# Altium schematic sheet H750Common2.SchDoc
size A3
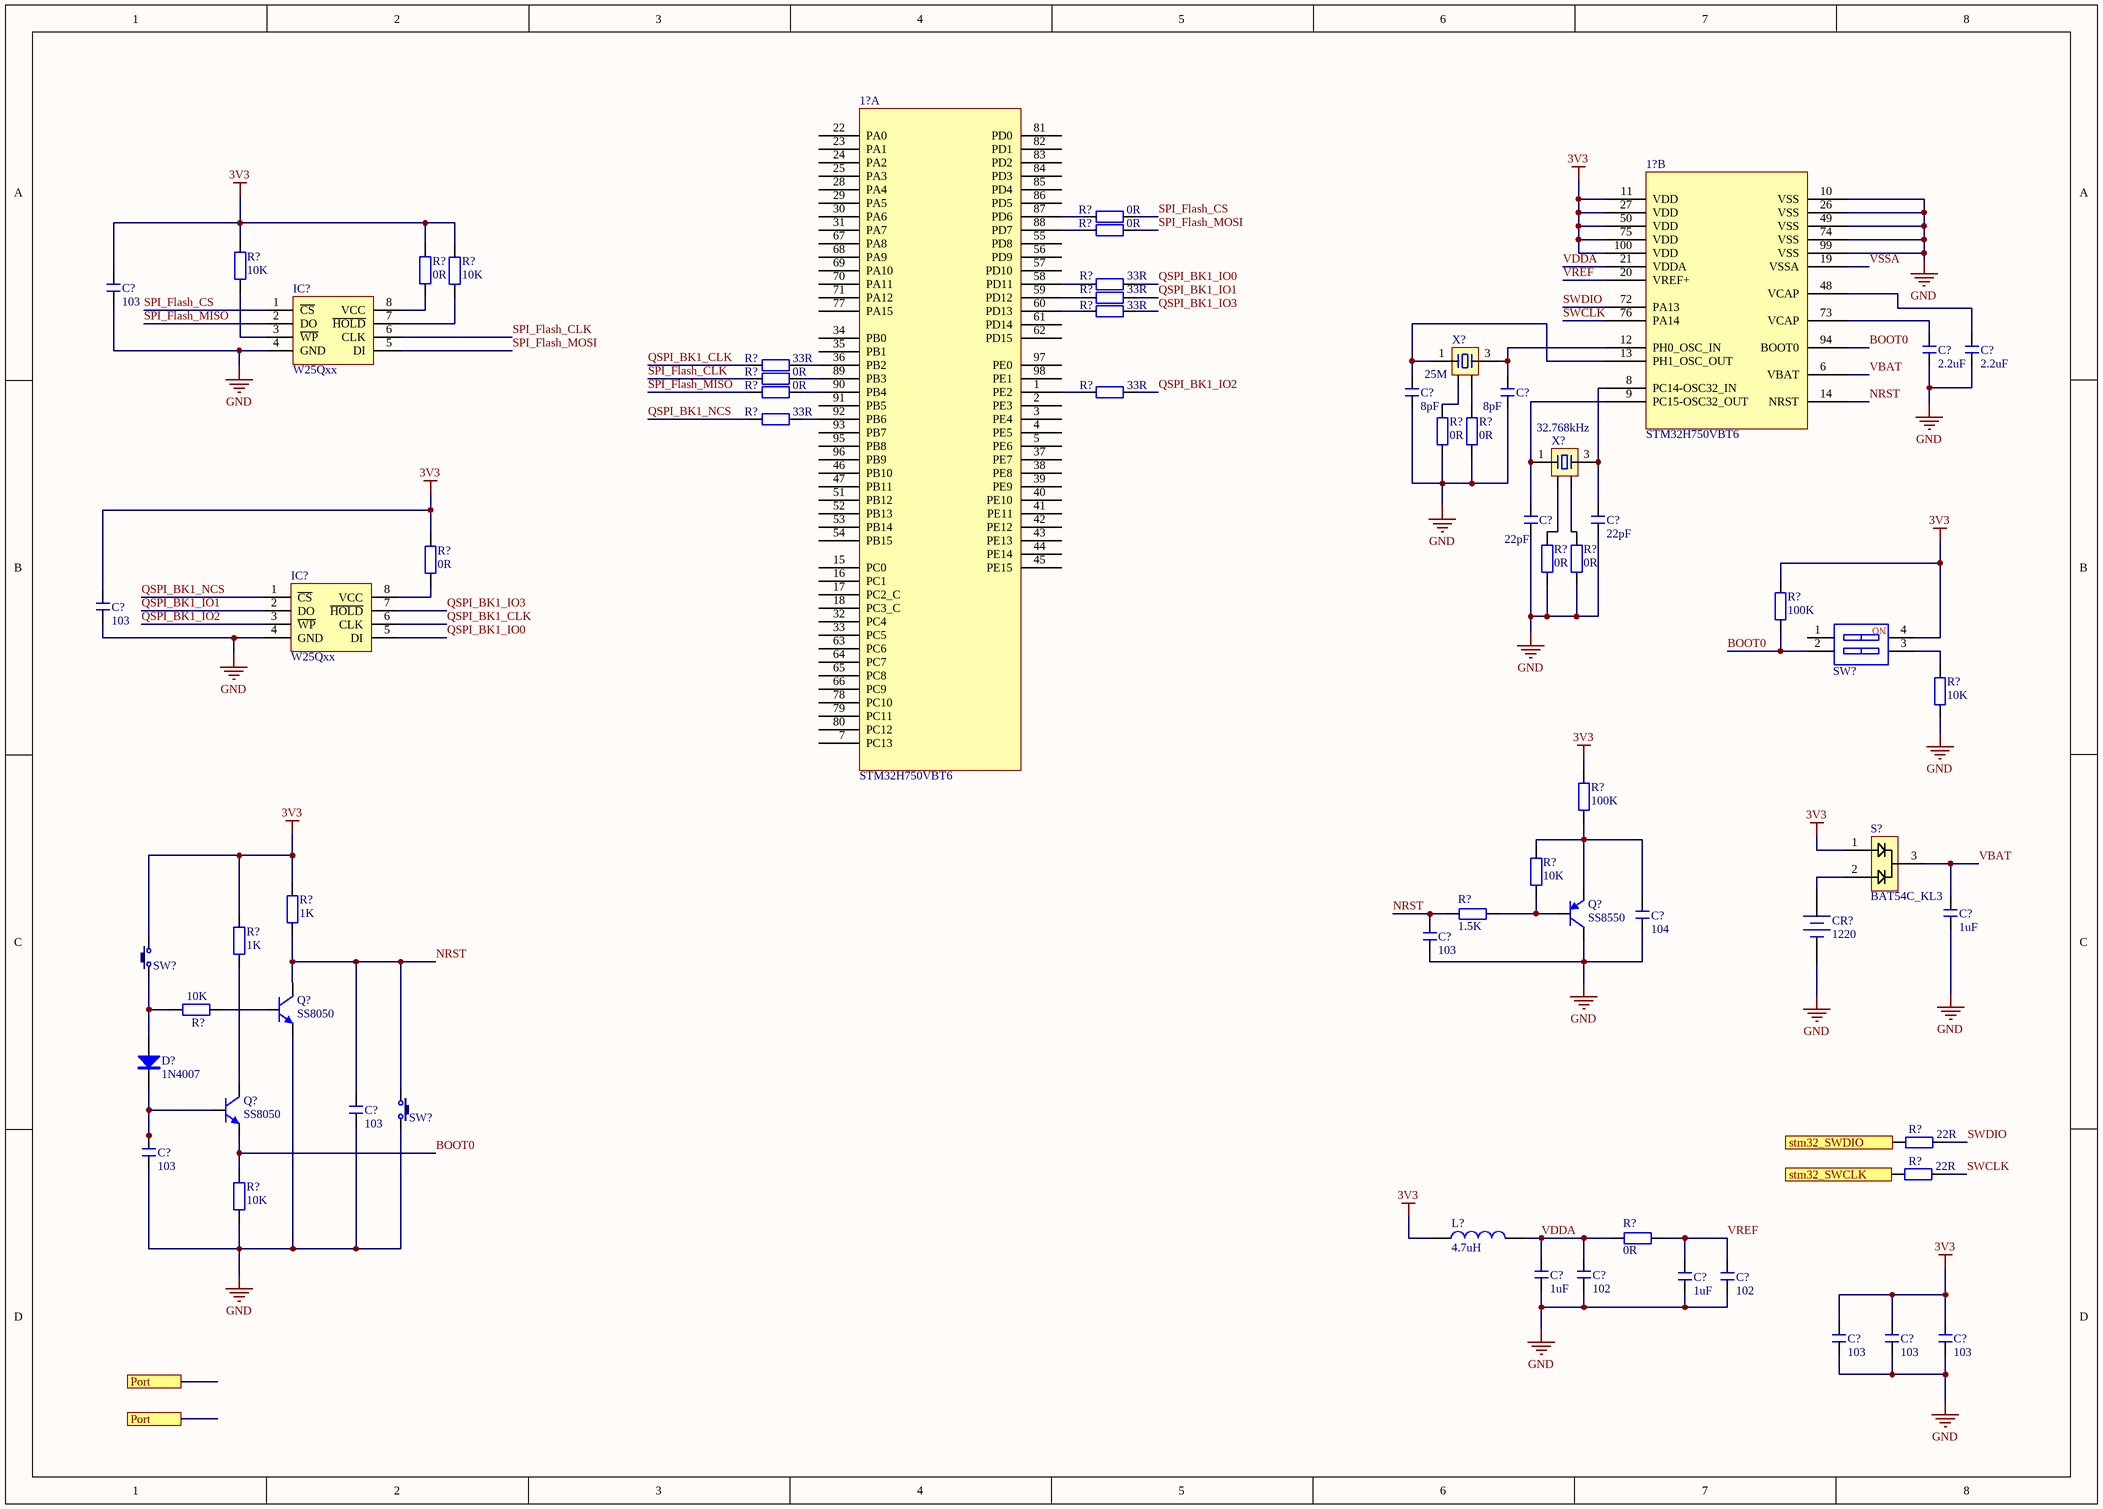
[diagram p0: H750Common2.SchDoc]

## Parts
(Parts that share a designator on the sheet are numbered #1, #2 ... from top to bottom, then left to right.)
1?#1  STM32H750VBT6  [F-QFP14x14-G100/P.5N]  (part B of 2)
1?#2  STM32H750VBT6  [F-QFP14x14-G100/P.5N]  (part A of 2)
C?#1  103  [C 0603_L]
C?#2  2.2uF  [C 0603_L]
C?#3  2.2uF  [C 0603_L]
C?#4  8pF  [C 0603_L]
C?#5  8pF  [C 0603_L]
C?#6  22pF  [C 0603_L]
C?#7  22pF  [C 0603_L]
C?#8  103  [C 0603_L]
C?#9  104  [C 0603_L]
C?#10  1uF  [C 0603_L]
C?#11  103  [C 0603_L]
C?#12  103  [C 0603_L]
C?#13  103  [C 0603_L]
C?#14  1uF  [C 0603_L]
C?#15  102  [C 0603_L]
C?#16  1uF  [C 0603_L]
C?#17  102  [C 0603_L]
C?#18  103  [C 0603_L]
C?#19  103  [C 0603_L]
C?#20  103  [C 0603_L]
CR?  1220  [CR1220_A]
D?  1N4007  [SMA]
IC?#1  W25Qxx  [SOP8W_N]
IC?#2  W25Qxx  [SOP8W_N]
L?  4.7uH  [L 0603]
Q?#1  SS8550  [SOT23-3N]
Q?#2  SS8050  [SOT23-3N]
Q?#3  SS8050  [SOT23-3N]
R?#1  0R  [R 0603_L]
R?#2  0R  [R 0603_L]
R?#3  10K  [R 0603_L]
R?#4  10K  [R 0603_L]
R?#5  33R  [R 0603_L]
R?#6  0R  [R 0603_L]
R?#7  33R  [R 0603_L]
R?#8  33R  [R 0603_L]
R?#9  33R  [R 0603_L]
R?#10  0R  [R 0603_L]
R?#11  0R  [R 0603_L]
R?#12  33R  [R 0603_L]
R?#13  33R  [R 0603_L]
R?#14  0R  [R 0603_L]
R?#15  0R  [R 0603_L]
R?#16  0R  [R 0603_L]
R?#17  0R  [R 0603_L]
R?#18  0R  [R 0603_L]
R?#19  100K  [R 0603_L]
R?#20  10K  [R 0603_L]
R?#21  100K  [R 0603_L]
R?#22  1K  [R 0603_L]
R?#23  10K  [R 0603_L]
R?#24  1K  [R 0603_L]
R?#25  1.5K  [R 0603_L]
R?#26  10K  [R 0603_L]
R?#27  22R  [R 0603_L]
R?#28  10K  [R 0603_L]
R?#29  22R  [R 0603_L]
R?#30  0R  [R 0603_L]
S?  BAT54C_KL3  [SO-G3/C2.25]
SW?#1  CSW-2P  [CSW1.27 SMD-2P]  (value not drawn)
SW?#2  3x6x5  [TSW SMD-3*6*2.5]  (value not drawn)
SW?#3  3x6x5  [TSW SMD-3*6*2.5]  (value not drawn)
X?#1  25M  [OSC 5032-4P]
X?#2  32.768kHz  [OSC 5032-4P]

## Ports
Port, stm32_SWCLK (in), stm32_SWDIO (in)

## Nets
3V3: 1?#1.11(VDD) 1?#1.27(VDD) 1?#1.50(VDD) 1?#1.75(VDD) 1?#1.100(VDD) C?#1.1 C?#8.1 C?#18.2 C?#19.2 C?#20.2 L?.1 R?#3.1 R?#4.1 R?#6.2 R?#16.2 R?#19.2 R?#21.2 R?#22.1 R?#24.1 S?.1 SW?#1.4 SW?#2.2
GND: 1?#1.10(VSS) 1?#1.26(VSS) 1?#1.49(VSS) 1?#1.74(VSS) 1?#1.99(VSS) C?#1.2 C?#2.1 C?#3.1 C?#4.1 C?#5.1 C?#6.1 C?#7.1 C?#8.2 C?#9.1 C?#10.1 C?#11.1 C?#12.1 C?#13.1 C?#14.1 C?#15.1 C?#16.1 C?#17.1 C?#18.1 C?#19.1 C?#20.1 CR?.2(DC-) IC?#1.4(GND) IC?#2.4(GND) Q?#1.3(C) Q?#2.2(E) R?#14.1 R?#15.1 R?#17.1 R?#18.1 R?#20.1 R?#28.2 SW?#3.2
BOOT0: 1?#1.94(BOOT0) Q?#3.2(E) R?#19.1 R?#28.1 SW?#1.2
NRST: 1?#1.14(NRST) C?#11.2 C?#12.2 Q?#2.3(C) R?#22.2 R?#25.2 SW?#3.1
QSPI_BK1_CLK: IC?#2.6(CLK) R?#9.2
QSPI_BK1_IO0: IC?#2.5(DI) R?#5.1
QSPI_BK1_IO1: IC?#2.2(DO) R?#7.1
QSPI_BK1_IO2: IC?#2.3(~{WP}) R?#12.1
QSPI_BK1_IO3: IC?#2.7(~{HOLD}) R?#8.1
QSPI_BK1_NCS: IC?#2.1(~{CS}) R?#13.2
SPI_Flash_CLK: IC?#1.6(CLK) R?#10.2
SPI_Flash_CS: IC?#1.1(~{CS}) R?#1.1
SPI_Flash_MISO: IC?#1.2(DO) R?#11.2
SPI_Flash_MOSI: IC?#1.5(DI) R?#2.1
stm32_SWCLK: R?#29.2 ; port stm32_SWCLK
stm32_SWDIO: R?#27.2 ; port stm32_SWDIO
SWCLK: 1?#1.76(PA14) R?#29.1
SWDIO: 1?#1.72(PA13) R?#27.1
VBAT: 1?#1.6(VBAT) C?#10.2 S?.3
VDDA: 1?#1.21(VDDA) C?#14.2 C?#15.2 L?.2 R?#30.1
VREF: 1?#1.20(VREF+) C?#16.2 C?#17.2 R?#30.2
VSSA: 1?#1.19(VSSA)
Net1?#1_8: 1?#1.8(PC14-OSC32_IN) C?#7.2 X?#2.3
Net1?#1_9: 1?#1.9(PC15-OSC32_OUT) C?#6.2 X?#2.1
Net1?#1_12: 1?#1.12(PH0_OSC_IN) C?#5.2 X?#1.3
Net1?#1_13: 1?#1.13(PH1_OSC_OUT) C?#4.2 X?#1.1
Net1?#1_48: 1?#1.48(VCAP) C?#3.2
Net1?#1_73: 1?#1.73(VCAP) C?#2.2
Net1?#2_1: 1?#2.1(PE2) R?#12.2
Net1?#2_36: 1?#2.36(PB2) R?#9.1
Net1?#2_58: 1?#2.58(PD11) R?#5.2
Net1?#2_59: 1?#2.59(PD12) R?#7.2
Net1?#2_60: 1?#2.60(PD13) R?#8.2
Net1?#2_87: 1?#2.87(PD6) R?#1.2
Net1?#2_88: 1?#2.88(PD7) R?#2.2
Net1?#2_89: 1?#2.89(PB3) R?#10.1
Net1?#2_90: 1?#2.90(PB4) R?#11.1
Net1?#2_92: 1?#2.92(PB6) R?#13.1
NetC?#9_2: C?#9.2 Q?#1.2(E) R?#21.1 R?#23.2
NetC?#13_2: C?#13.2 D?.2(K) Q?#3.1(B)
NetCR?_1: CR?.1(DC+) S?.2
NetD?_1: D?.1(A) R?#26.2 SW?#2.1
NetIC?#1_3: IC?#1.3(~{WP}) R?#3.2
NetIC?#1_7: IC?#1.7(~{HOLD}) R?#4.2
NetIC?#1_8: IC?#1.8(VCC) R?#6.1
NetIC?#2_8: IC?#2.8(VCC) R?#16.1
NetQ?#1_1: Q?#1.1(B) R?#23.1 R?#25.1
NetQ?#2_1: Q?#2.1(B) R?#26.1
NetQ?#3_3: Q?#3.3(C) R?#24.2
NetR?#14_2: R?#14.2 X?#1.2
NetR?#15_2: R?#15.2 X?#1.4
NetR?#17_2: R?#17.2 X?#2.2
NetR?#18_2: R?#18.2 X?#2.4
NetR?#20_2: R?#20.2 SW?#1.3

Not connected (* = marked no-connect by the designer): 1?#2 2(PE3) 3(PE4) 4(PE5) 5(PE6) 7(PC13) 15(PC0) 16(PC1) 17(PC2_C) 18(PC3_C) 22(PA0) 23(PA1) 24(PA2) 25(PA3) 28(PA4) 29(PA5) 30(PA6) 31(PA7) 32(PC4) 33(PC5) 34(PB0) 35(PB1) 37(PE7) 38(PE8) 39(PE9) 40(PE10) 41(PE11) 42(PE12) 43(PE13) 44(PE14) 45(PE15) 46(PB10) 47(PB11) 51(PB12) 52(PB13) 53(PB14) 54(PB15) 55(PD8) 56(PD9) 57(PD10) 61(PD14) 62(PD15) 63(PC6) 64(PC7) 65(PC8) 66(PC9) 67(PA8) 68(PA9) 69(PA10) 70(PA11) 71(PA12) 77(PA15) 78(PC10) 79(PC11) 80(PC12) 81(PD0) 82(PD1) 83(PD2) 84(PD3) 85(PD4) 86(PD5) 91(PB5) 93(PB7) 95(PB8) 96(PB9) 97(PE0) 98(PE1); SW?#1 1

## Notes on the sheet
- (in symbol CSW-2P) NO

## Library data of the parts
1?#1 1?#2 = STM32H750VB
C?#1-C?#20 = C: 无极性贴片电容; 版权归属: 源创客; BOM名称: 无极性贴片电容; 学习资源: www.ooocke.com
CR? = CR-3V: 微型电池; 版权归属: 源创客; BOM名称: 微型电池; 学习资源: www.ooocke.com
D? = 1N4007: 整流二极管; 版权归属: 源创客; BOM名称: 整流二极管; 学习资源: www.ooocke.com
IC?#1 IC?#2 = W25Qxx: 外置Flash; 版权归属: 源创客; BOM名称: 外置Flash; 学习资源: www.ooocke.com
L? = L: 小功率贴片电感; 版权归属: 源创客; BOM名称: 小功率贴片电感; 学习资源: www.ooocke.com
Q?#1 = 8550-SMD: 高频放大-PNP型; 版权归属: 源创客; 属性: 40V 1.5A 1W 100MHZ; BOM名称: 高频放大-PNP型; 学习资源: www.ooocke.com
Q?#2 Q?#3 = 8050-SMD: 高频放大-NPN型; 版权归属: 源创客; 属性: 40V 1.5A 1W 100MHZ; BOM名称: 高频放大-NPN型; 学习资源: www.ooocke.com
R?#1-R?#30 = R: 贴片电阻; 版权归属: 源创客; BOM名称: 贴片电阻; 学习资源: www.ooocke.com
S? = BAT54C_KL3_1
SW?#1 = CSW-2P: 2路编码开关; 版权归属: 源创客; BOM名称: 2路编码开关; 学习资源: www.ooocke.com
SW?#2 SW?#3 = TSW 3x6: 3x6轻触开关; 版权归属: 源创客; BOM名称: 3x6轻触开关; 学习资源: www.ooocke.com
X?#1 X?#2 = XTAL-4P: 4脚无源晶振; 版权归属: 源创客; BOM名称: 4脚无源晶振; 学习资源: www.ooocke.com